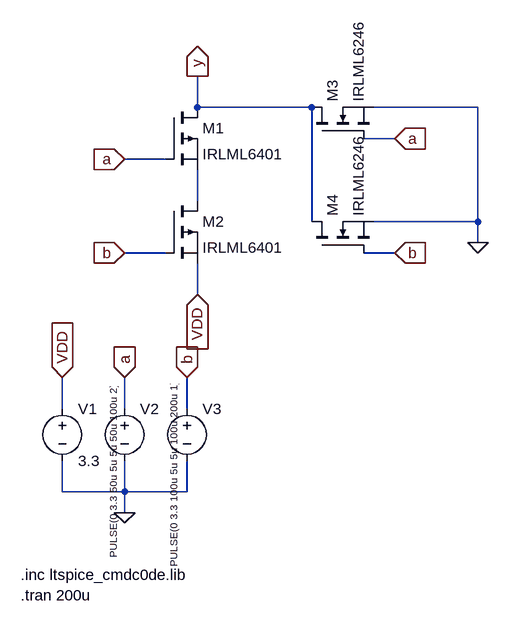
[diagram p0: schematic nor_raw.asc]
nor_raw.asc, the LTspice schematic file:
Version 4.1
SHEET 1 880 700
WIRE 144 -64 144 -112
WIRE 320 -64 144 -64
WIRE 576 -64 416 -64
WIRE 448 -16 400 -16
WIRE 96 16 32 16
WIRE 144 80 144 32
WIRE 320 112 320 -64
WIRE 576 112 576 -64
WIRE 576 112 416 112
WIRE 576 144 576 112
WIRE 96 160 32 160
WIRE 448 160 400 160
WIRE 144 224 144 176
WIRE -64 400 -64 352
WIRE 32 400 32 352
WIRE 128 400 128 352
WIRE -64 528 -64 480
WIRE 32 528 32 480
WIRE 32 528 -64 528
WIRE 128 528 128 480
WIRE 128 528 32 528
WIRE 32 560 32 528
FLAG 144 -112 y
IOPIN 144 -112 Out
FLAG 32 16 a
IOPIN 32 16 In
FLAG 32 160 b
IOPIN 32 160 In
FLAG 144 224 VDD
IOPIN 144 224 In
FLAG 448 -16 a
IOPIN 448 -16 In
FLAG 448 160 b
IOPIN 448 160 In
FLAG 576 144 0
FLAG 32 560 0
FLAG -64 352 VDD
IOPIN -64 352 In
FLAG 32 352 a
IOPIN 32 352 In
FLAG 128 352 b
IOPIN 128 352 In
SYMBOL pmos 96 -64 R0
SYMATTR InstName M1
SYMATTR Value IRLML6401
SYMBOL pmos 96 80 R0
SYMATTR InstName M2
SYMATTR Value IRLML6401
SYMBOL nmos 320 -16 R270
SYMATTR InstName M3
SYMATTR Value IRLML6246
SYMBOL nmos 320 160 R270
SYMATTR InstName M4
SYMATTR Value IRLML6246
SYMBOL voltage -64 384 R0
WINDOW 123 0 0 Left 0
WINDOW 39 0 0 Left 0
SYMATTR InstName V1
SYMATTR Value 3.3
SYMBOL voltage 32 384 R0
WINDOW 3 -17 246 VLeft 1
WINDOW 123 0 0 Left 0
WINDOW 39 0 0 Left 0
SYMATTR Value PULSE(0 3.3 50u 5u 5u 50u 100u 2)
SYMATTR InstName V2
SYMBOL voltage 128 384 R0
WINDOW 3 -20 260 VLeft 1
WINDOW 123 0 0 Left 0
WINDOW 39 0 0 Left 0
SYMATTR Value PULSE(0 3.3 100u 5u 5u 100u 200u 1)
SYMATTR InstName V3
TEXT -128 656 Left 2 !.inc ltspice_cmdc0de.lib\n.tran 200u

The netlist it stands for:
* nor_raw.asc
M1 y a N001 N001 IRLML6401
M2 N001 b VDD VDD IRLML6401
M3 y a 0 0 IRLML6246
M4 y b 0 0 IRLML6246
V1 VDD 0 3.3
V2 a 0 PULSE(0 3.3 50u 5u 5u 50u 100u 2)
V3 b 0 PULSE(0 3.3 100u 5u 5u 100u 200u 1)
.model NMOS NMOS
.model PMOS PMOS
.lib standard.mos
.inc ltspice_cmdc0de.lib
.tran 200u
.backanno
.end